# EAGLE schematic XMICRO-SERIAL V1.1 (EAGLE 6.3)

## Sheet 1 of 6: UARTs
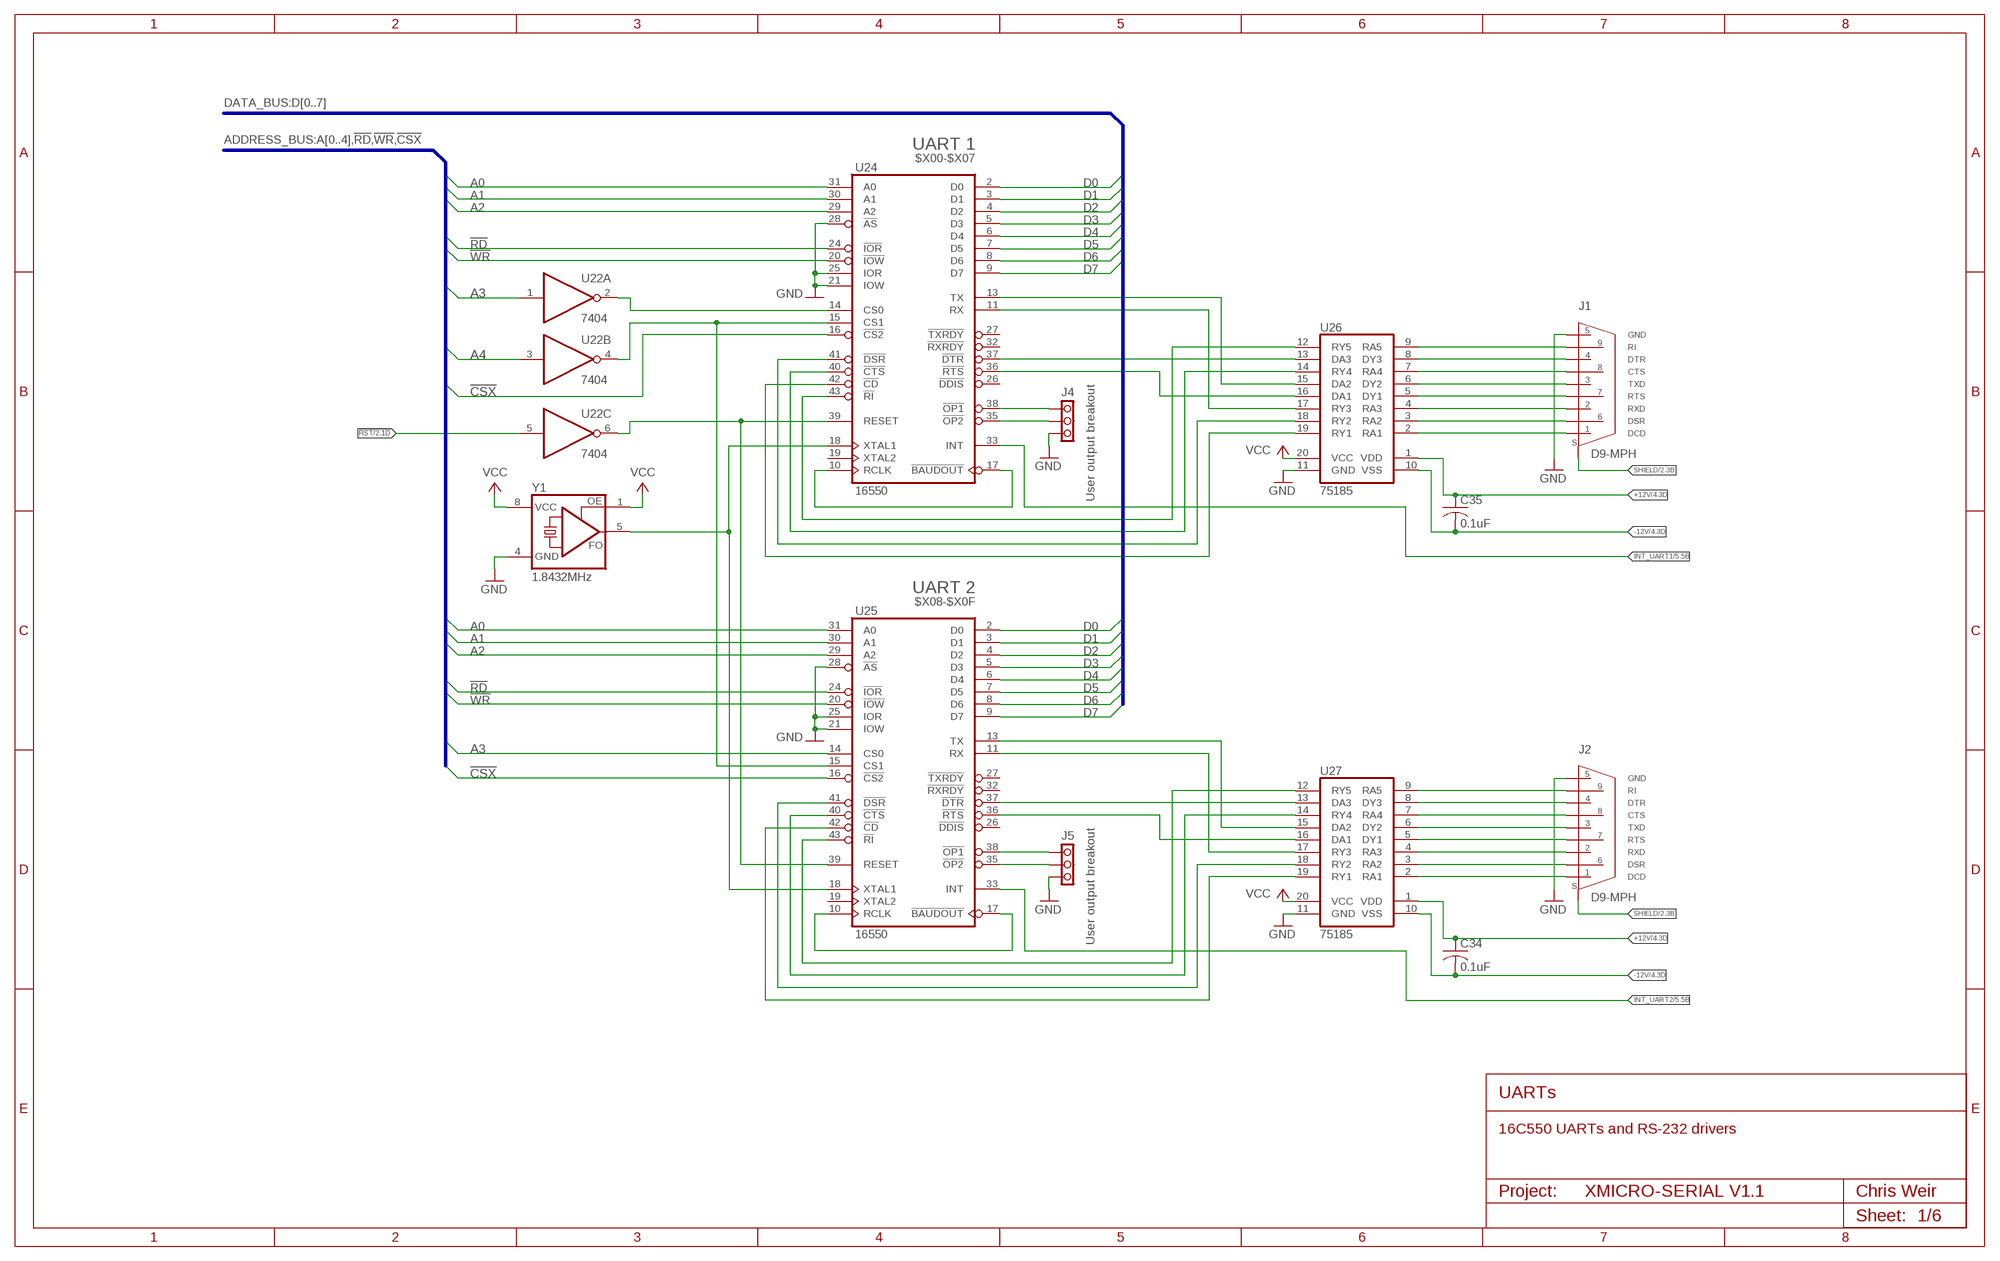
[diagram p0: schematic, sheet 1]

### Parts
C34  0.1uF  C-US100  [C100]
C35  0.1uF  C-US100  [C100]
J1  D9-MPH  [D9-H]
J2  D9-MPH  [D9-H]
J4  PINHD1X3  [1X03]
J5  PINHD1X3  [1X03]
U22  7404  74LS04N  [DIL14]
U24  16550  16C550S44  [S44]
U25  16550  16C550S44  [S44]
U26  75185  75C185N  [DIL20]
U27  75185  75C185N  [DIL20]
Y1  1.8432MHz  OSC-OE  [DIL08S]

### Nets
!CSX: U24.16(!CS2) U25.16(!CS2) ; also sheet 4,5
!RD: U24.24(!IOR) U25.24(!IOR) ; also sheet 4,5
!RST: U22.5(C:I) ; also sheet 2,3,4
!WR: U24.20(!IOW) U25.20(!IOW) ; also sheet 4,5
+12V [SUPPLY]: C34.P$1 C35.P$1 U26.1(VDD) U27.1(VDD) ; also sheet 4,6
-12V [SUPPLY]: C34.P$2 C35.P$2 U26.10(VSS) U27.10(VSS) ; also sheet 4,6
A0: U24.31(A0) U25.31(A0) ; also sheet 4,5
A1: U24.30(A1) U25.30(A1) ; also sheet 4,5
A2: U24.29(A2) U25.29(A2) ; also sheet 4,5
A3: U22.1(A:I) U25.14(CS0) ; also sheet 4
A4: U22.3(B:I) ; also sheet 4,5
D0: U24.2(D0) U25.2(D0) ; also sheet 2,3,4,5
D1: U24.3(D1) U25.3(D1) ; also sheet 2,3,4,5
D2: U24.4(D2) U25.4(D2) ; also sheet 2,3,4,5
D3: U24.5(D3) U25.5(D3) ; also sheet 2,3,4,5
D4: U24.6(D4) U25.6(D4) ; also sheet 2,3,4,5
D5: U24.7(D5) U25.7(D5) ; also sheet 2,3,4,5
D6: U24.8(D6) U25.8(D6) ; also sheet 2,3,4,5
D7: U24.9(D7) U25.9(D7) ; also sheet 2,3,4,5
GND [GND]: J1.P$5 J2.P$5 J4.3 J5.3 U24.21(IOW) U24.25(IOR) U24.28(!AS) U25.21(IOW) U25.25(IOR) U25.28(!AS) U26.11(GND) U27.11(GND) Y1.4(GND) ; also sheet 2,3,4,5,6
INT_UART1: U24.33(INT) ; also sheet 5,6
INT_UART2: U25.33(INT) ; also sheet 5,6
N$1: J1.P$1 U26.2(RA1)
N$2: J1.P$2 U26.4(RA3)
N$3: J1.P$3 U26.6(DY2)
N$4: J1.P$4 U26.8(DY3)
N$5: J1.P$6 U26.3(RA2)
N$6: J1.P$7 U26.5(DY1)
N$7: J1.P$8 U26.7(RA4)
N$8: J1.P$9 U26.9(RA5)
N$9: J2.P$1 U27.2(RA1)
N$10: U24.43(!RI) U26.12(RY5)
N$11: U24.37(!DTR) U26.13(DA3)
N$12: U24.40(!CTS) U26.14(RY4)
N$13: U24.13(TX) U26.15(DA2)
N$14: U24.36(!RTS) U26.16(DA1)
N$15: U24.11(RX) U26.17(RY3)
N$16: U24.41(!DSR) U26.18(RY2)
N$17: U24.42(!CD) U26.19(RY1)
N$18: U24.10(RCLK) U24.17(!BAUDOUT)
N$26: U22.6(C:O) U24.39(RESET) U25.39(RESET)
N$28: J2.P$2 U27.4(RA3)
N$29: J2.P$3 U27.6(DY2)
N$30: J2.P$4 U27.8(DY3)
N$31: J2.P$6 U27.3(RA2)
N$32: J2.P$7 U27.5(DY1)
N$41: J2.P$8 U27.7(RA4)
N$42: J2.P$9 U27.9(RA5)
N$47: U25.43(!RI) U27.12(RY5)
N$48: U25.37(!DTR) U27.13(DA3)
N$49: U25.40(!CTS) U27.14(RY4)
N$60: U25.13(TX) U27.15(DA2)
N$61: U25.36(!RTS) U27.16(DA1)
N$62: U25.11(RX) U27.17(RY3)
N$63: U25.41(!DSR) U27.18(RY2)
N$64: U25.42(!CD) U27.19(RY1)
N$65: U25.10(RCLK) U25.17(!BAUDOUT)
N$112: U22.2(A:O) U24.14(CS0)
N$114: U22.4(B:O) U24.15(CS1) U25.15(CS1)
N$116: U24.18(XTAL1) U25.18(XTAL1) Y1.5(FO)
N$122: J5.1 U25.38(!OP1)
N$123: J5.2 U25.35(!OP2)
N$125: J4.1 U24.38(!OP1)
N$136: J4.2 U24.35(!OP2)
SHIELD [SHIELD]: J1.S1 J1.S2 J2.S1 J2.S2 ; also sheet 2,6
VCC [SUPPLY]: U26.20(VCC) U27.20(VCC) Y1.1(OE) Y1.8(VCC) ; also sheet 2,3,4,6
Unconnected: U24.19(XTAL2) U24.26(!DDIS) U24.27(!TXRDY) U24.32(!RXRDY) U25.19(XTAL2) U25.26(!DDIS) U25.27(!TXRDY) U25.32(!RXRDY)

### Buses
DATA_BUS:D[0..7]
ADDRESS_BUS:A[0..4],!RD,!WR,!CSX

### Notes on the sheet
- UART 1
- $X00-$X07
- GND
- RI
- DTR
- CTS
- User output breakout | TXD
- RTS
- RXD
- DSR
- DCD
- UART 2
- $X08-$X0F
- GND
- RI
- DTR
- CTS
- User output breakout | TXD
- RTS
- RXD
- DSR
- DCD
- UARTs
- 16C550 UARTs and RS-232 drivers
- Project: | Chris Weir
- Sheet:

## Sheet 2 of 6: PS/2 Read
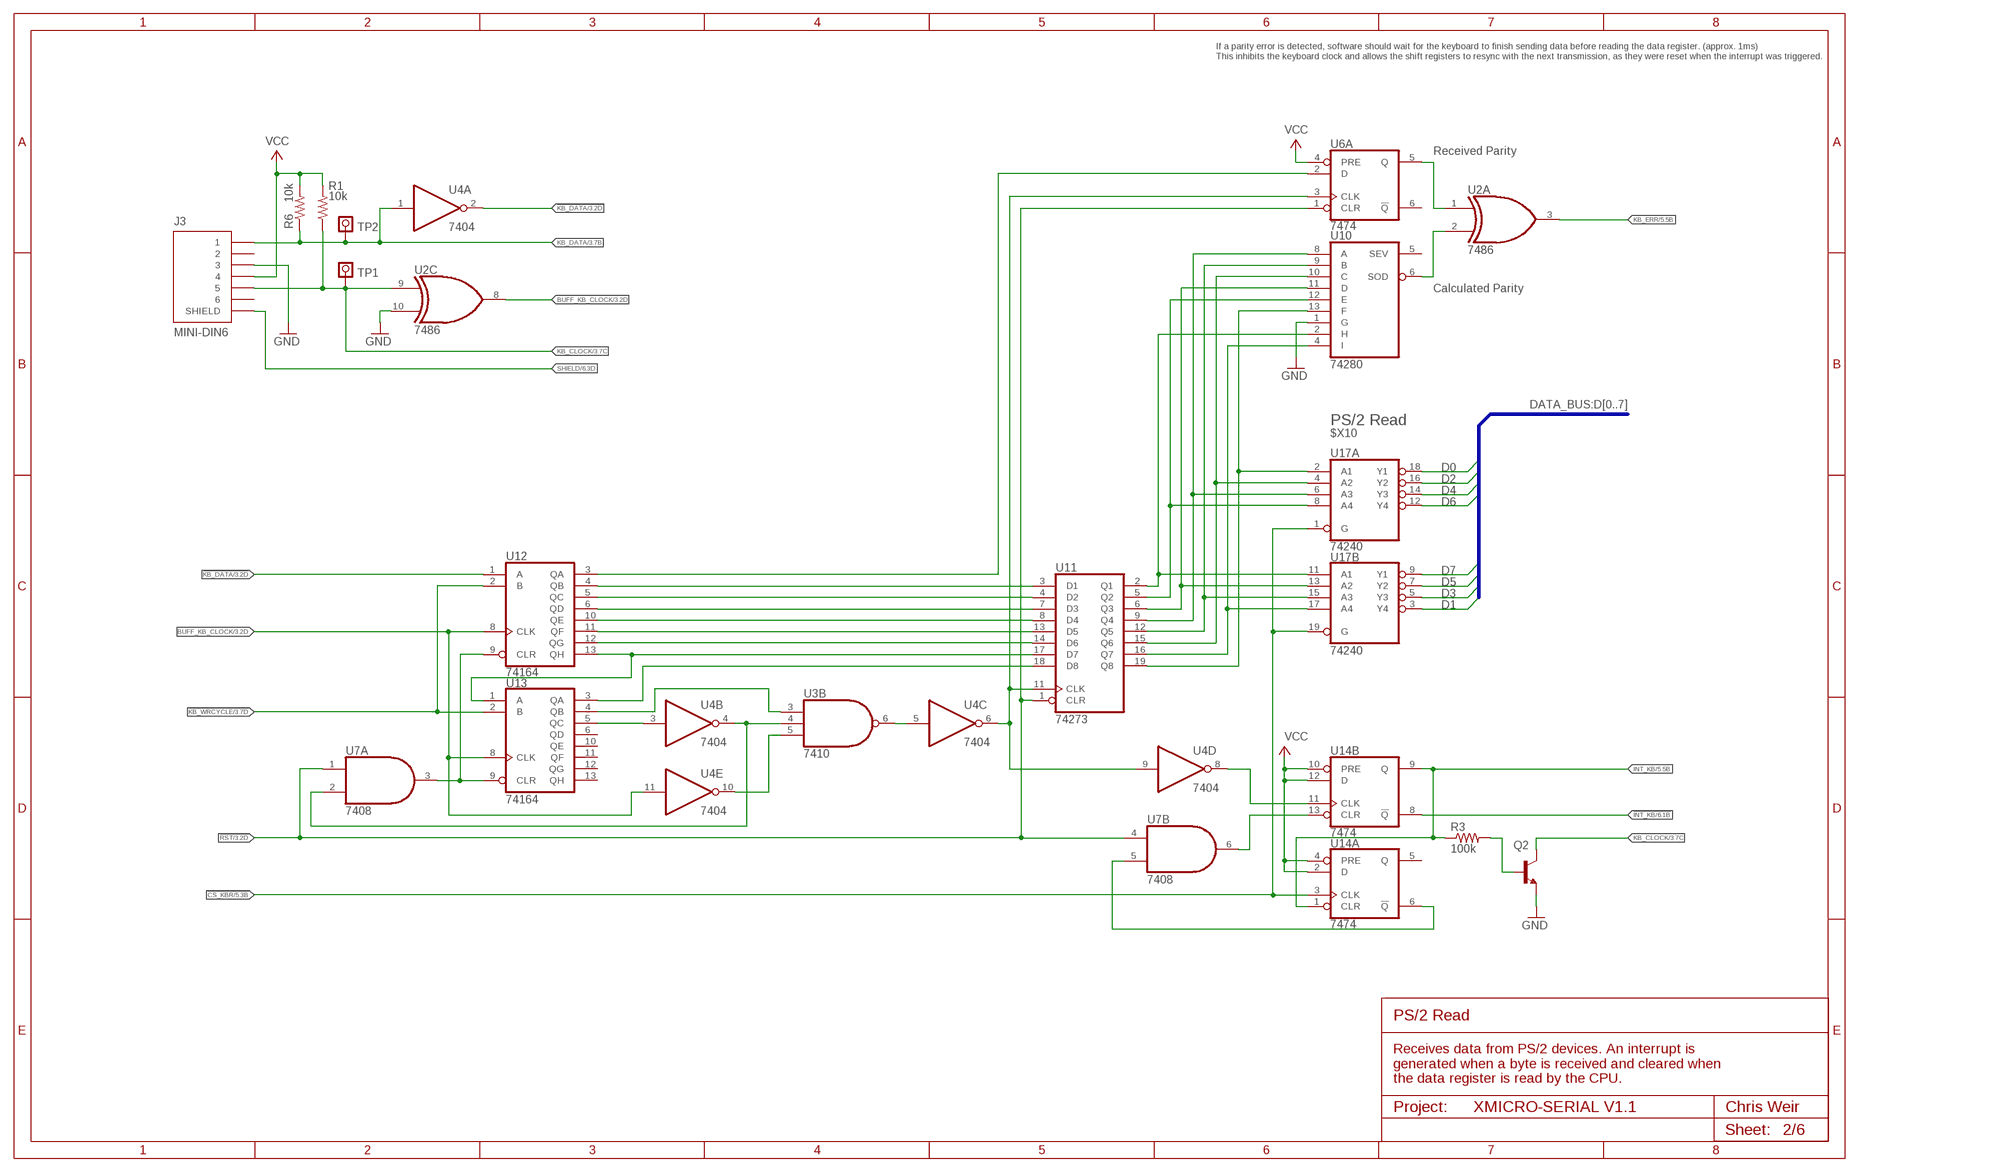
[diagram p1: schematic, sheet 2]

### Parts
J3  MINI-DIN6  [MINI-DIN6]
Q2  2N5088  TRANSISTOR-NPN-2N5088  [TO92]
R1  10k  R-US_0207/10  [0207/10]
R3  100k  R-US_0207/10  [0207/10]
R6  10k  R-US_0207/10  [0207/10]
TP1  PINHD-1X1  [1X01]
TP2  PINHD-1X1  [1X01]
U2  7486  74LS86N  [DIL14]
U3  7410  74LS10N  [DIL14]
U4  7404  74LS04N  [DIL14]
U6  7474  74LS74N  [DIL14]
U7  7408  74LS08N  [DIL14]
U10  74280  74LS280N  [DIL14]
U11  74273  74273N  [DIL20]
U12  74164  74HCT164N  [DIL14]
U13  74164  74HCT164N  [DIL14]
U14  7474  74LS74N  [DIL14]
U17  74240  74LS240N  [DIL20]

### Nets
!CS_KBR: U14.3(A:CLK) U17.1(A:G) U17.19(B:G) ; also sheet 5
!INT_KB: U14.8(B:!Q) ; also sheet 6
!KB_DATA: U4.2(A:O) U12.1(A) ; also sheet 3
!KB_WRCYCLE: U12.2(B) U13.2(B) ; also sheet 3
!RST: U6.1(A:CLR) U7.1(A:I0) U7.4(B:I0) U11.1(CLR) ; also sheet 1,3,4
BUFF_KB_CLOCK: U2.8(C:O) U4.11(E:I) U12.8(CLK) U13.8(CLK) ; also sheet 3
D0: U17.18(A:Y1) ; also sheet 1,3,4,5
D1: U17.3(B:Y4) ; also sheet 1,3,4,5
D2: U17.16(A:Y2) ; also sheet 1,3,4,5
D3: U17.5(B:Y3) ; also sheet 1,3,4,5
D4: U17.14(A:Y3) ; also sheet 1,3,4,5
D5: U17.7(B:Y2) ; also sheet 1,3,4,5
D6: U17.12(A:Y4) ; also sheet 1,3,4,5
D7: U17.9(B:Y1) ; also sheet 1,3,4,5
GND [GND]: J3.3 Q2.1(E) U2.10(C:I1) U10.1(G) ; also sheet 1,3,4,5,6
INT_KB: R3.1 U14.1(A:CLR) U14.9(B:Q) ; also sheet 5
KB_CLOCK: J3.5 Q2.3(C) R1.1 TP1.1 U2.9(C:I0) ; also sheet 3
KB_DATA: J3.1 R6.1 TP2.1 U4.1(A:I) ; also sheet 3
KB_ERR: U2.3(A:O) ; also sheet 5
N$19: U3.6(B:O) U4.5(C:I)
N$20: U4.8(D:O) U14.11(B:CLK)
N$66: U11.17(D7) U12.13(QH) U13.1(A)
N$67: U11.18(D8) U13.3(QA)
N$69: U4.3(B:I) U13.5(QC)
N$70: U3.4(B:I1) U4.4(B:O) U7.2(A:I1)
N$71: U4.6(C:O) U4.9(D:I) U6.3(A:CLK) U11.11(CLK)
N$72: U3.3(B:I0) U13.4(QB)
N$73: U11.14(D6) U12.12(QG)
N$74: U11.13(D5) U12.11(QF)
N$76: U11.7(D3) U12.6(QD)
N$77: U11.4(D2) U12.5(QC)
N$78: U11.3(D1) U12.4(QB)
N$79: U6.2(A:D) U12.3(QA)
N$81: U7.3(A:O) U12.9(CLR) U13.9(CLR)
N$82: U7.6(B:O) U14.13(B:CLR)
N$84: U2.1(A:I0) U6.5(A:Q)
N$86: U10.13(F) U11.19(Q8) U17.2(A:A1)
N$90: U10.4(I) U11.16(Q7) U17.17(B:A4)
N$91: U10.10(C) U11.15(Q6) U17.4(A:A2)
N$92: U10.9(B) U11.12(Q5) U17.15(B:A3)
N$94: U10.11(D) U11.6(Q3) U17.13(B:A2)
N$95: U10.12(E) U11.5(Q2) U17.8(A:A4)
N$96: U10.2(H) U11.2(Q1) U17.11(B:A1)
N$97: U10.8(A) U11.9(Q4) U17.6(A:A3)
N$101: U2.2(A:I1) U10.6(SOD)
N$102: U3.5(B:I2) U4.10(E:O)
N$105: Q2.2(B) R3.2
N$108: U7.5(B:I1) U14.6(A:!Q)
SHIELD [SHIELD]: J3.G$1(SHIELD) J3.G$2(SHIELD) J3.G$3(SHIELD) ; also sheet 1,6
UC4: U11.8(D4) U12.10(QE)
VCC [SUPPLY]: J3.4 R1.2 R6.2 U6.4(A:PRE) U14.2(A:D) U14.4(A:PRE) U14.10(B:PRE) U14.12(B:D) ; also sheet 1,3,4,6
Unconnected: J3.2 J3.6 U6.6(A:!Q) U10.5(SEV) U13.6(QD) U13.10(QE) U13.11(QF) U13.12(QG) U13.13(QH) U14.5(A:Q)

### Buses
DATA_BUS:D[0..7]

### Notes on the sheet
- If a parity error is detected, software should wait for the keyboard to finish sending data before reading the data register. (approx. 1ms)
  This inhibits the keyboard clock and allows the shift registers to resync with the next transmission, as they were reset when the interrupt was triggered.
- Received Parity
- Calculated Parity
- PS/2 Read
- $X10
- PS/2 Read
- Receives data from PS/2 devices. An interrupt is
  generated when a byte is received and cleared when
  the data register is read by the CPU.
- Project: | Chris Weir
- Sheet:

## Sheet 3 of 6: PS/2 Write
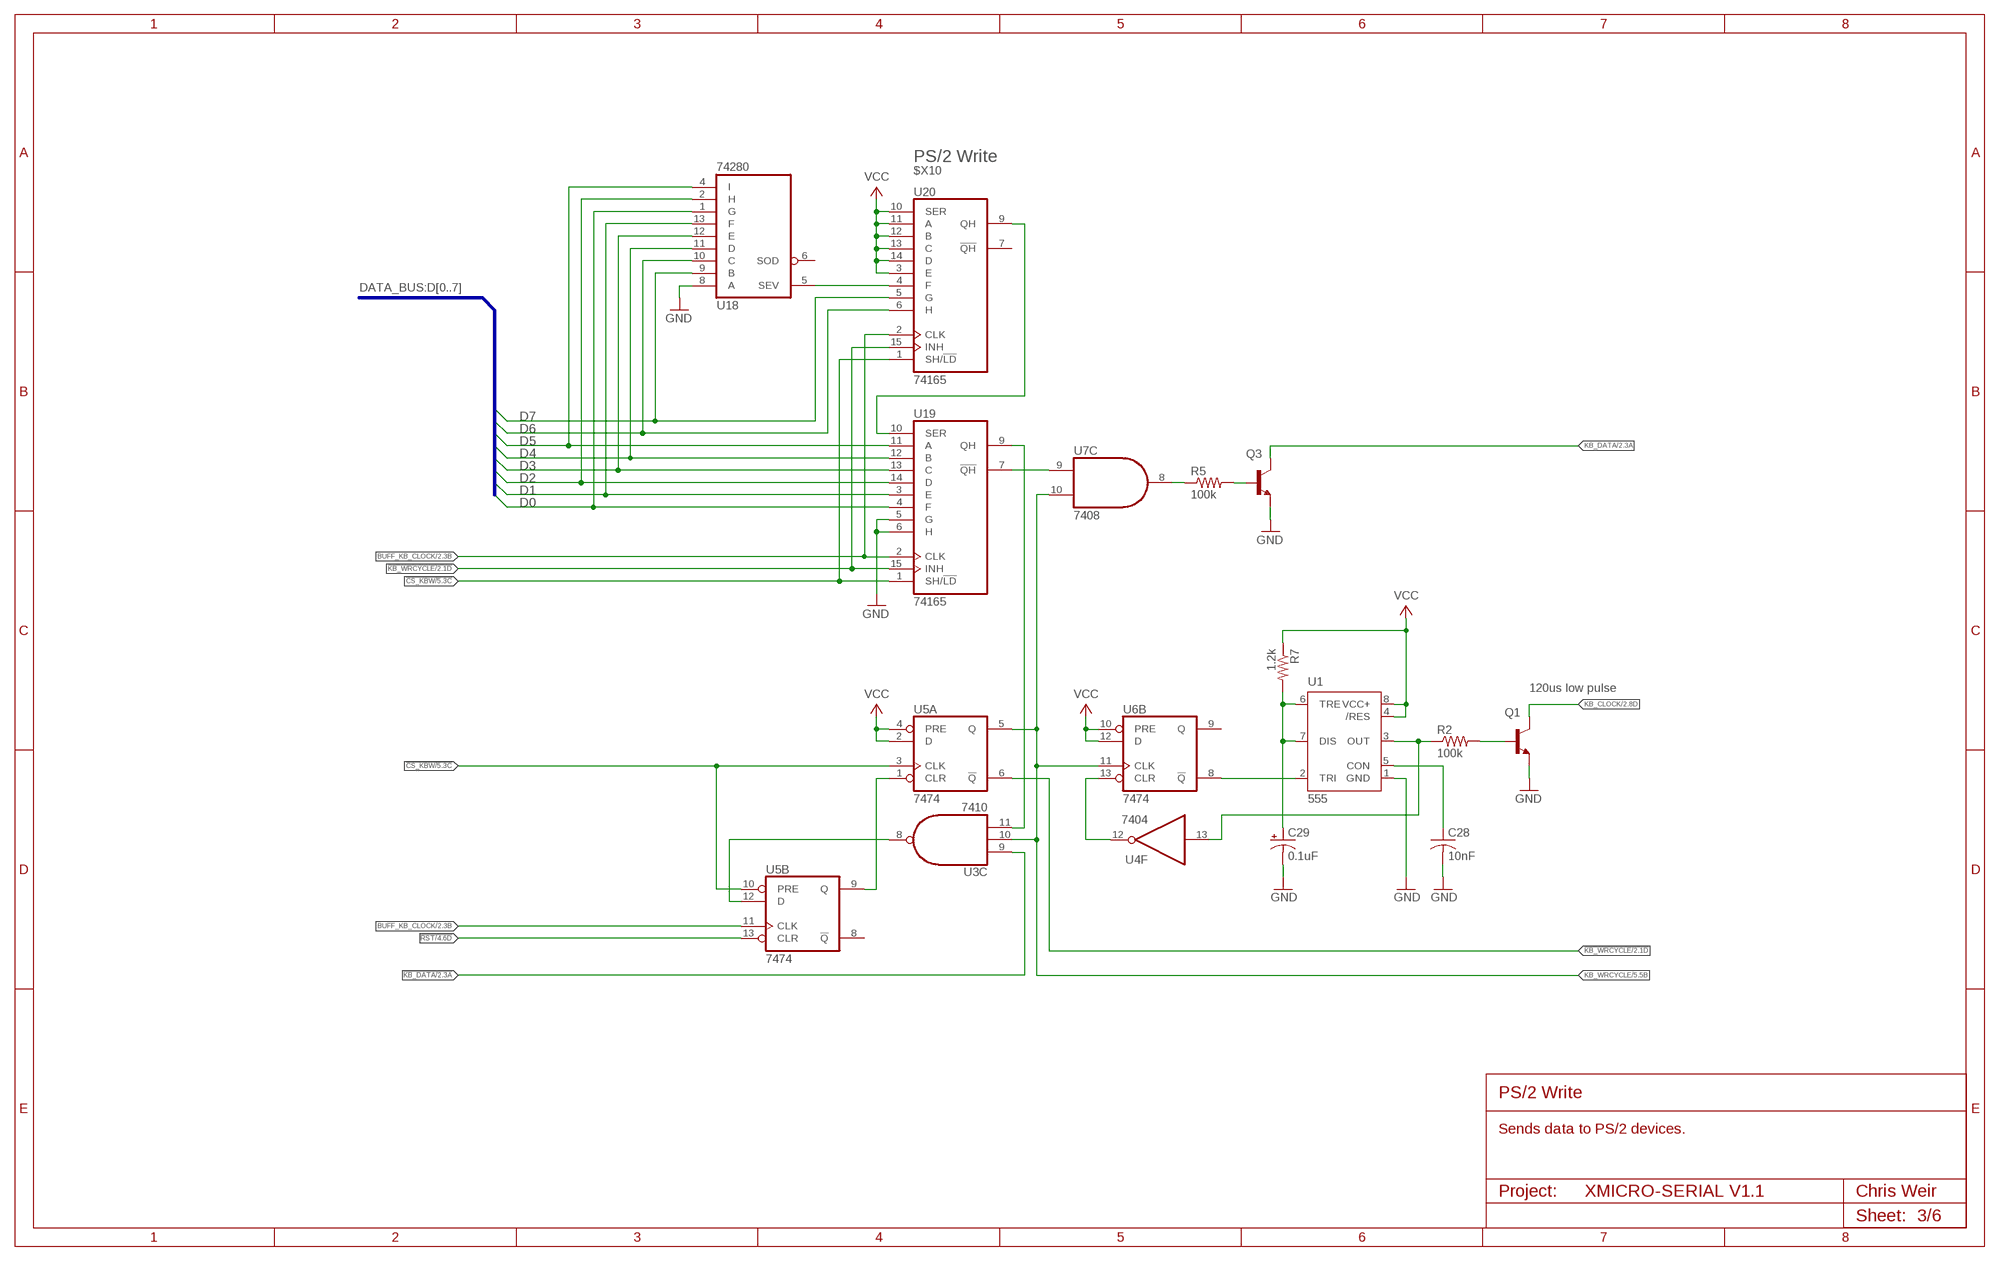
[diagram p2: schematic, sheet 3]

### Parts
C28  10nF  C-US100  [C100]
C29  0.1uF  CPOL-USE2.5-6  [E2,5-6]
Q1  2N5088  TRANSISTOR-NPN-2N5088  [TO92]
Q3  2N5088  TRANSISTOR-NPN-2N5088  [TO92]
R2  100k  R-US_0207/10  [0207/10]
R5  100k  R-US_0207/10  [0207/10]
R7  1.2k  R-US_0207/10  [0207/10]
U1  555  NE555  [DIL-08]
U5  7474  74LS74N  [DIL14]
U18  74280  74LS280N  [DIL14]
U19  74165  74LS165N  [DIL16]
U20  74165  74LS165N  [DIL16]

### Nets
!CS_KBW: U5.3(A:CLK) U5.10(B:PRE) U19.1(SH/!LD) U20.1(SH/!LD) ; also sheet 5
!KB_DATA: U3.9(C:I0) ; also sheet 2
!KB_WRCYCLE: U5.6(A:!Q) U19.15(INH) U20.15(INH) ; also sheet 2
!RST: U5.13(B:CLR) ; also sheet 1,2,4
BUFF_KB_CLOCK: U5.11(B:CLK) U19.2(CLK) U20.2(CLK) ; also sheet 2
D0: U18.1(G) U19.4(F) ; also sheet 1,2,4,5
D1: U18.13(F) U19.3(E) ; also sheet 1,2,4,5
D2: U18.2(H) U19.14(D) ; also sheet 1,2,4,5
D3: U18.12(E) U19.13(C) ; also sheet 1,2,4,5
D4: U18.11(D) U19.12(B) ; also sheet 1,2,4,5
D5: U18.4(I) U19.11(A) ; also sheet 1,2,4,5
D6: U18.10(C) U20.6(H) ; also sheet 1,2,4,5
D7: U18.9(B) U20.5(G) ; also sheet 1,2,4,5
GND [GND]: C28.P$2 C29.- Q1.1(E) Q3.1(E) U1.1(GND) U18.8(A) U19.5(G) U19.6(H) ; also sheet 1,2,4,5,6
KB_CLOCK: Q1.3(C) ; also sheet 2
KB_DATA: Q3.3(C) ; also sheet 2
KB_WRCYCLE: U3.10(C:I1) U5.5(A:Q) U6.11(B:CLK) U7.10(C:I1) ; also sheet 5
N$22: U3.8(C:O) U5.12(B:D)
N$23: U4.12(F:O) U6.13(B:CLR)
N$87: U3.11(C:I2) U19.9(QH)
N$99: U7.9(C:I0) U19.7(!QH)
N$103: R5.1 U7.8(C:O)
N$111: U19.10(SER) U20.9(QH)
N$120: U18.5(SEV) U20.4(F)
N$124: Q3.2(B) R5.2
N$126: Q1.2(B) R2.2
N$131: U5.1(A:CLR) U5.9(B:Q)
N$132: U1.2(TRI) U6.8(B:!Q)
N$133: C29.+ R7.2 U1.6(TRE) U1.7(DIS)
N$137: R2.1 U1.3(OUT) U4.13(F:I)
N$140: C28.P$1 U1.5(CON)
VCC [SUPPLY]: R7.1 U1.4(/RES) U1.8(VCC+) U5.2(A:D) U5.4(A:PRE) U6.10(B:PRE) U6.12(B:D) U20.3(E) U20.10(SER) U20.11(A) U20.12(B) U20.13(C) U20.14(D) ; also sheet 1,2,4,6
Unconnected: U5.8(B:!Q) U6.9(B:Q) U18.6(SOD) U20.7(!QH)

### Buses
DATA_BUS:D[0..7]

### Notes on the sheet
- PS/2 Write
- $X10
- 120us low pulse
- PS/2 Write
- Sends data to PS/2 devices.
- Project: | Chris Weir
- Sheet:

## Sheet 4 of 6: Bus Connector/Buffers
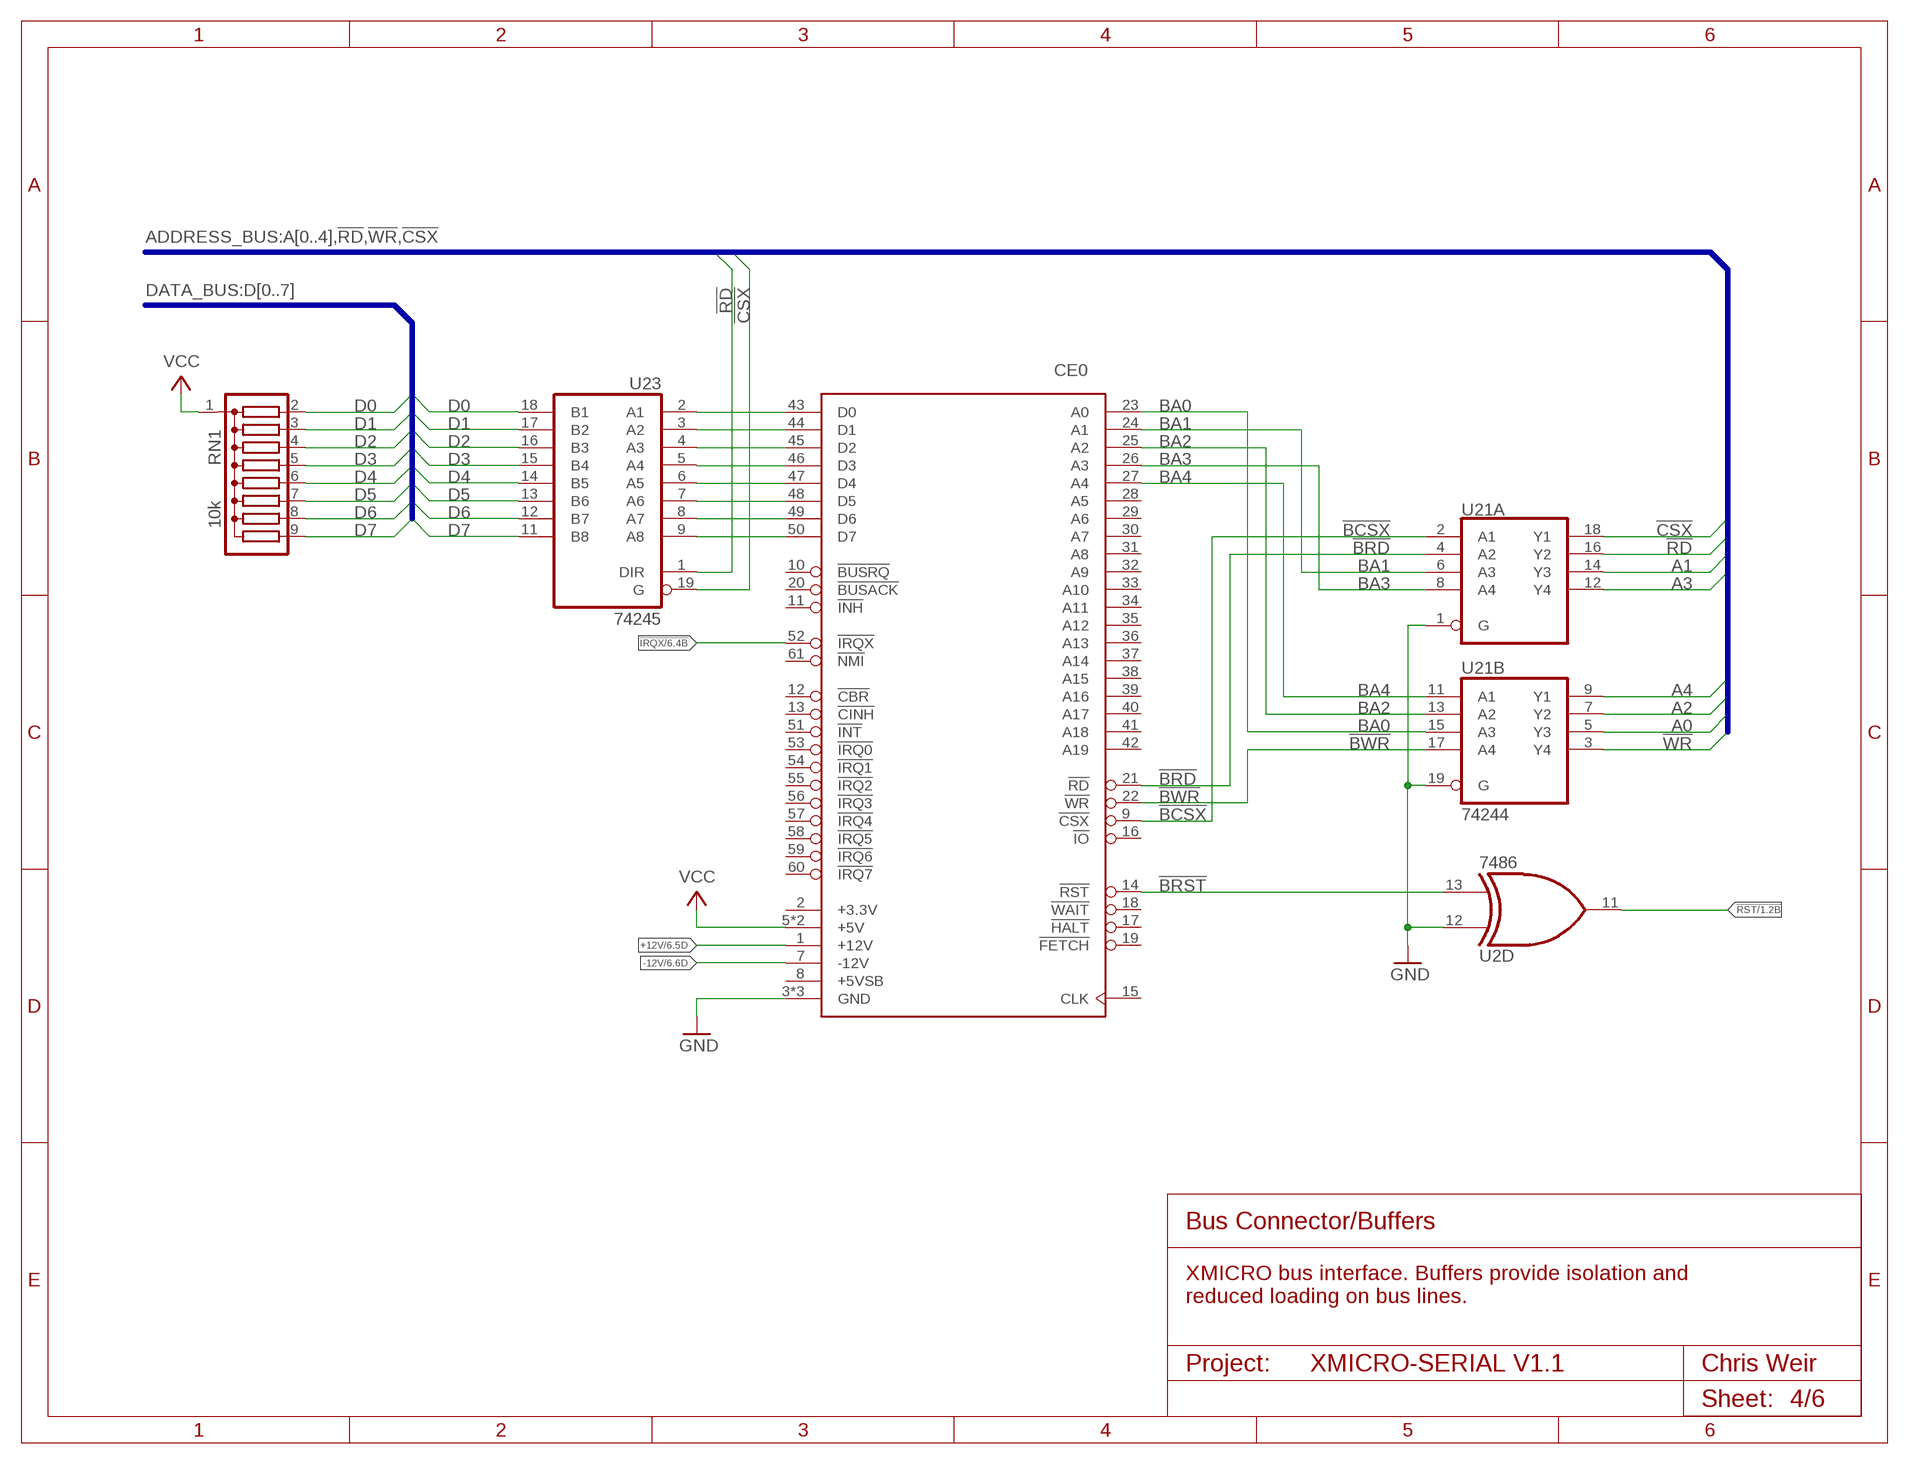
[diagram p3: schematic, sheet 4]

### Parts
CE0  XMICRO-BUS-EDGE62M  [EDGE62M]
RN1  10k  G08R  [SIL9]
U21  74244  74LS244N  [DIL20]
U23  74245  74LS245N  [DIL20]

### Nets
!BCSX: CE0.9(!CSX) U21.2(A:A1)
!BRD: CE0.21(!RD) U21.4(A:A2)
!BRST: CE0.14(!RST) U2.13(D:I1)
!BWR: CE0.22(!WR) U21.17(B:A4)
!CSX: U21.18(A:Y1) U23.19(G) ; also sheet 1,5
!IRQX: CE0.52(!IRQX) ; also sheet 6
!RD: U21.16(A:Y2) U23.1(DIR) ; also sheet 1,5
!RST: U2.11(D:O) ; also sheet 1,2,3
!WR: U21.3(B:Y4) ; also sheet 1,5
+12V [SUPPLY]: CE0.1(+12V) ; also sheet 1,6
-12V [SUPPLY]: CE0.7(-12V) ; also sheet 1,6
A0: U21.5(B:Y3) ; also sheet 1,5
A1: U21.14(A:Y3) ; also sheet 1,5
A2: U21.7(B:Y2) ; also sheet 1,5
A3: U21.12(A:Y4) ; also sheet 1
A4: U21.9(B:Y1) ; also sheet 1,5
BA0: CE0.23(A0) U21.15(B:A3)
BA1: CE0.24(A1) U21.6(A:A3)
BA2: CE0.25(A2) U21.13(B:A2)
BA3: CE0.26(A3) U21.8(A:A4)
BA4: CE0.27(A4) U21.11(B:A1)
D0: RN1.2 U23.18(B1) ; also sheet 1,2,3,5
D1: RN1.3 U23.17(B2) ; also sheet 1,2,3,5
D2: RN1.4 U23.16(B3) ; also sheet 1,2,3,5
D3: RN1.5 U23.15(B4) ; also sheet 1,2,3,5
D4: RN1.6 U23.14(B5) ; also sheet 1,2,3,5
D5: RN1.7 U23.13(B6) ; also sheet 1,2,3,5
D6: RN1.8 U23.12(B7) ; also sheet 1,2,3,5
D7: RN1.9 U23.11(B8) ; also sheet 1,2,3,5
GND [GND]: CE0.3(GND) CE0.4(GND) CE0.62(GND) U2.12(D:I0) U21.1(A:G) U21.19(B:G) ; also sheet 1,2,3,5,6
N$33: CE0.50(D7) U23.9(A8)
N$34: CE0.49(D6) U23.8(A7)
N$35: CE0.48(D5) U23.7(A6)
N$36: CE0.47(D4) U23.6(A5)
N$37: CE0.46(D3) U23.5(A4)
N$38: CE0.45(D2) U23.4(A3)
N$39: CE0.44(D1) U23.3(A2)
N$40: CE0.43(D0) U23.2(A1)
VCC [SUPPLY]: CE0.5(+5V) CE0.6(+5V) RN1.1 ; also sheet 1,2,3,6
Unconnected: CE0.2(+3.3V) CE0.8(+5VSB) CE0.10(!BUSRQ) CE0.11(!INH) CE0.12(!CBR) CE0.13(!CINH) CE0.15(CLK) CE0.16(!IO) CE0.17(!HALT) CE0.18(!WAIT) CE0.19(!FETCH) CE0.20(!BUSACK) CE0.28(A5) CE0.29(A6) CE0.30(A7) CE0.31(A8) CE0.32(A9) CE0.33(A10) CE0.34(A11) CE0.35(A12) CE0.36(A13) CE0.37(A14) CE0.38(A15) CE0.39(A16) CE0.40(A17) CE0.41(A18) CE0.42(A19) CE0.51(!INT) CE0.53(!IRQ0) CE0.54(!IRQ1) CE0.55(!IRQ2) CE0.56(!IRQ3) CE0.57(!IRQ4) CE0.58(!IRQ5) CE0.59(!IRQ6) CE0.60(!IRQ7) CE0.61(!NMI)

### Buses
DATA_BUS:D[0..7]
ADDRESS_BUS:A[0..4],!RD,!WR,!CSX

### Notes on the sheet
- Bus Connector/Buffers
- XMICRO bus interface. Buffers provide isolation and 
  reduced loading on bus lines.
- Project: | Chris Weir
- Sheet:

## Sheet 5 of 6: Chip Selects/Card Registers
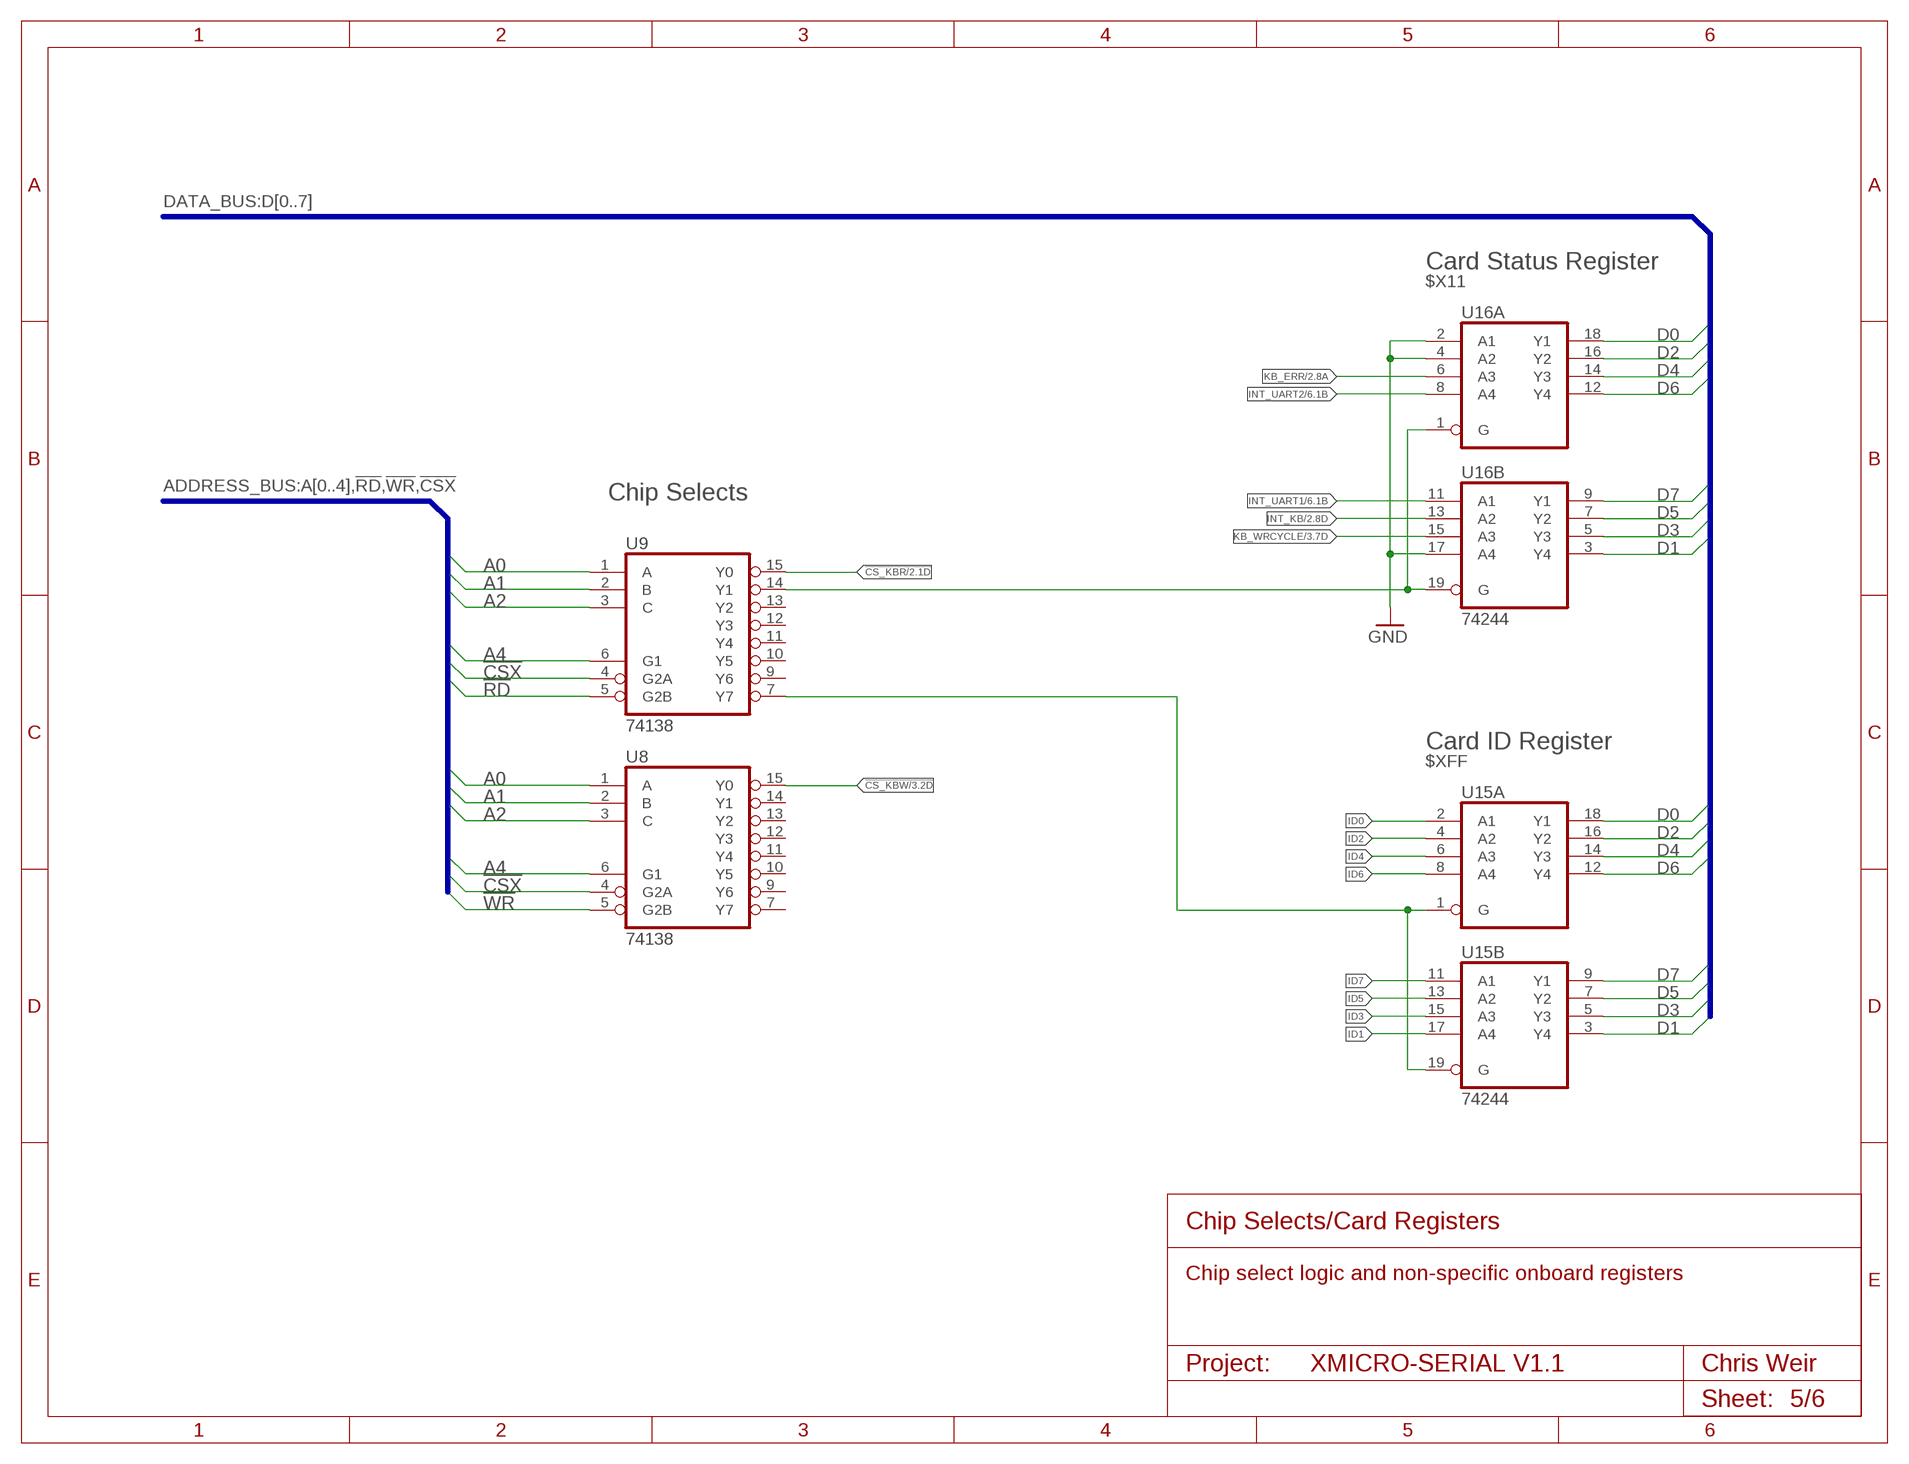
[diagram p4: schematic, sheet 5]

### Parts
U8  74138  74LS138N  [DIL16]
U9  74138  74LS138N  [DIL16]
U15  74244  74LS244N  [DIL20]
U16  74244  74LS244N  [DIL20]

### Nets
!CS_IDR: U9.7(Y7) U15.1(A:G) U15.19(B:G)
!CS_KBR: U9.15(Y0) ; also sheet 2
!CS_KBW: U8.15(Y0) ; also sheet 3
!CS_STR: U9.14(Y1) U16.1(A:G) U16.19(B:G)
!CSX: U8.4(G2A) U9.4(G2A) ; also sheet 1,4
!RD: U9.5(G2B) ; also sheet 1,4
!WR: U8.5(G2B) ; also sheet 1,4
A0: U8.1(A) U9.1(A) ; also sheet 1,4
A1: U8.2(B) U9.2(B) ; also sheet 1,4
A2: U8.3(C) U9.3(C) ; also sheet 1,4
A4: U8.6(G1) U9.6(G1) ; also sheet 1,4
D0: U15.18(A:Y1) U16.18(A:Y1) ; also sheet 1,2,3,4
D1: U15.3(B:Y4) U16.3(B:Y4) ; also sheet 1,2,3,4
D2: U15.16(A:Y2) U16.16(A:Y2) ; also sheet 1,2,3,4
D3: U15.5(B:Y3) U16.5(B:Y3) ; also sheet 1,2,3,4
D4: U15.14(A:Y3) U16.14(A:Y3) ; also sheet 1,2,3,4
D5: U15.7(B:Y2) U16.7(B:Y2) ; also sheet 1,2,3,4
D6: U15.12(A:Y4) U16.12(A:Y4) ; also sheet 1,2,3,4
D7: U15.9(B:Y1) U16.9(B:Y1) ; also sheet 1,2,3,4
GND [GND]: U16.2(A:A1) U16.4(A:A2) U16.17(B:A4) ; also sheet 1,2,3,4,6
ID0: U15.2(A:A1)
ID1: U15.17(B:A4)
ID2: U15.4(A:A2)
ID3: U15.15(B:A3)
ID4: U15.6(A:A3)
ID5: U15.13(B:A2)
ID6: U15.8(A:A4)
ID7: U15.11(B:A1)
INT_KB: U16.13(B:A2) ; also sheet 2
INT_UART1: U16.11(B:A1) ; also sheet 1,6
INT_UART2: U16.8(A:A4) ; also sheet 1,6
KB_ERR: U16.6(A:A3) ; also sheet 2
KB_WRCYCLE: U16.15(B:A3) ; also sheet 3
Unconnected: U8.7(Y7) U8.9(Y6) U8.10(Y5) U8.11(Y4) U8.12(Y3) U8.13(Y2) U8.14(Y1) U9.9(Y6) U9.10(Y5) U9.11(Y4) U9.12(Y3) U9.13(Y2)

### Buses
DATA_BUS:D[0..7]
ADDRESS_BUS:A[0..4],!RD,!WR,!CSX

### Notes on the sheet
- Card Status Register
- $X11
- Chip Selects
- Card ID Register
- $XFF
- Chip Selects/Card Registers
- Chip select logic and non-specific onboard registers
- Project: | Chris Weir
- Sheet:

## Sheet 6 of 6: Misc.
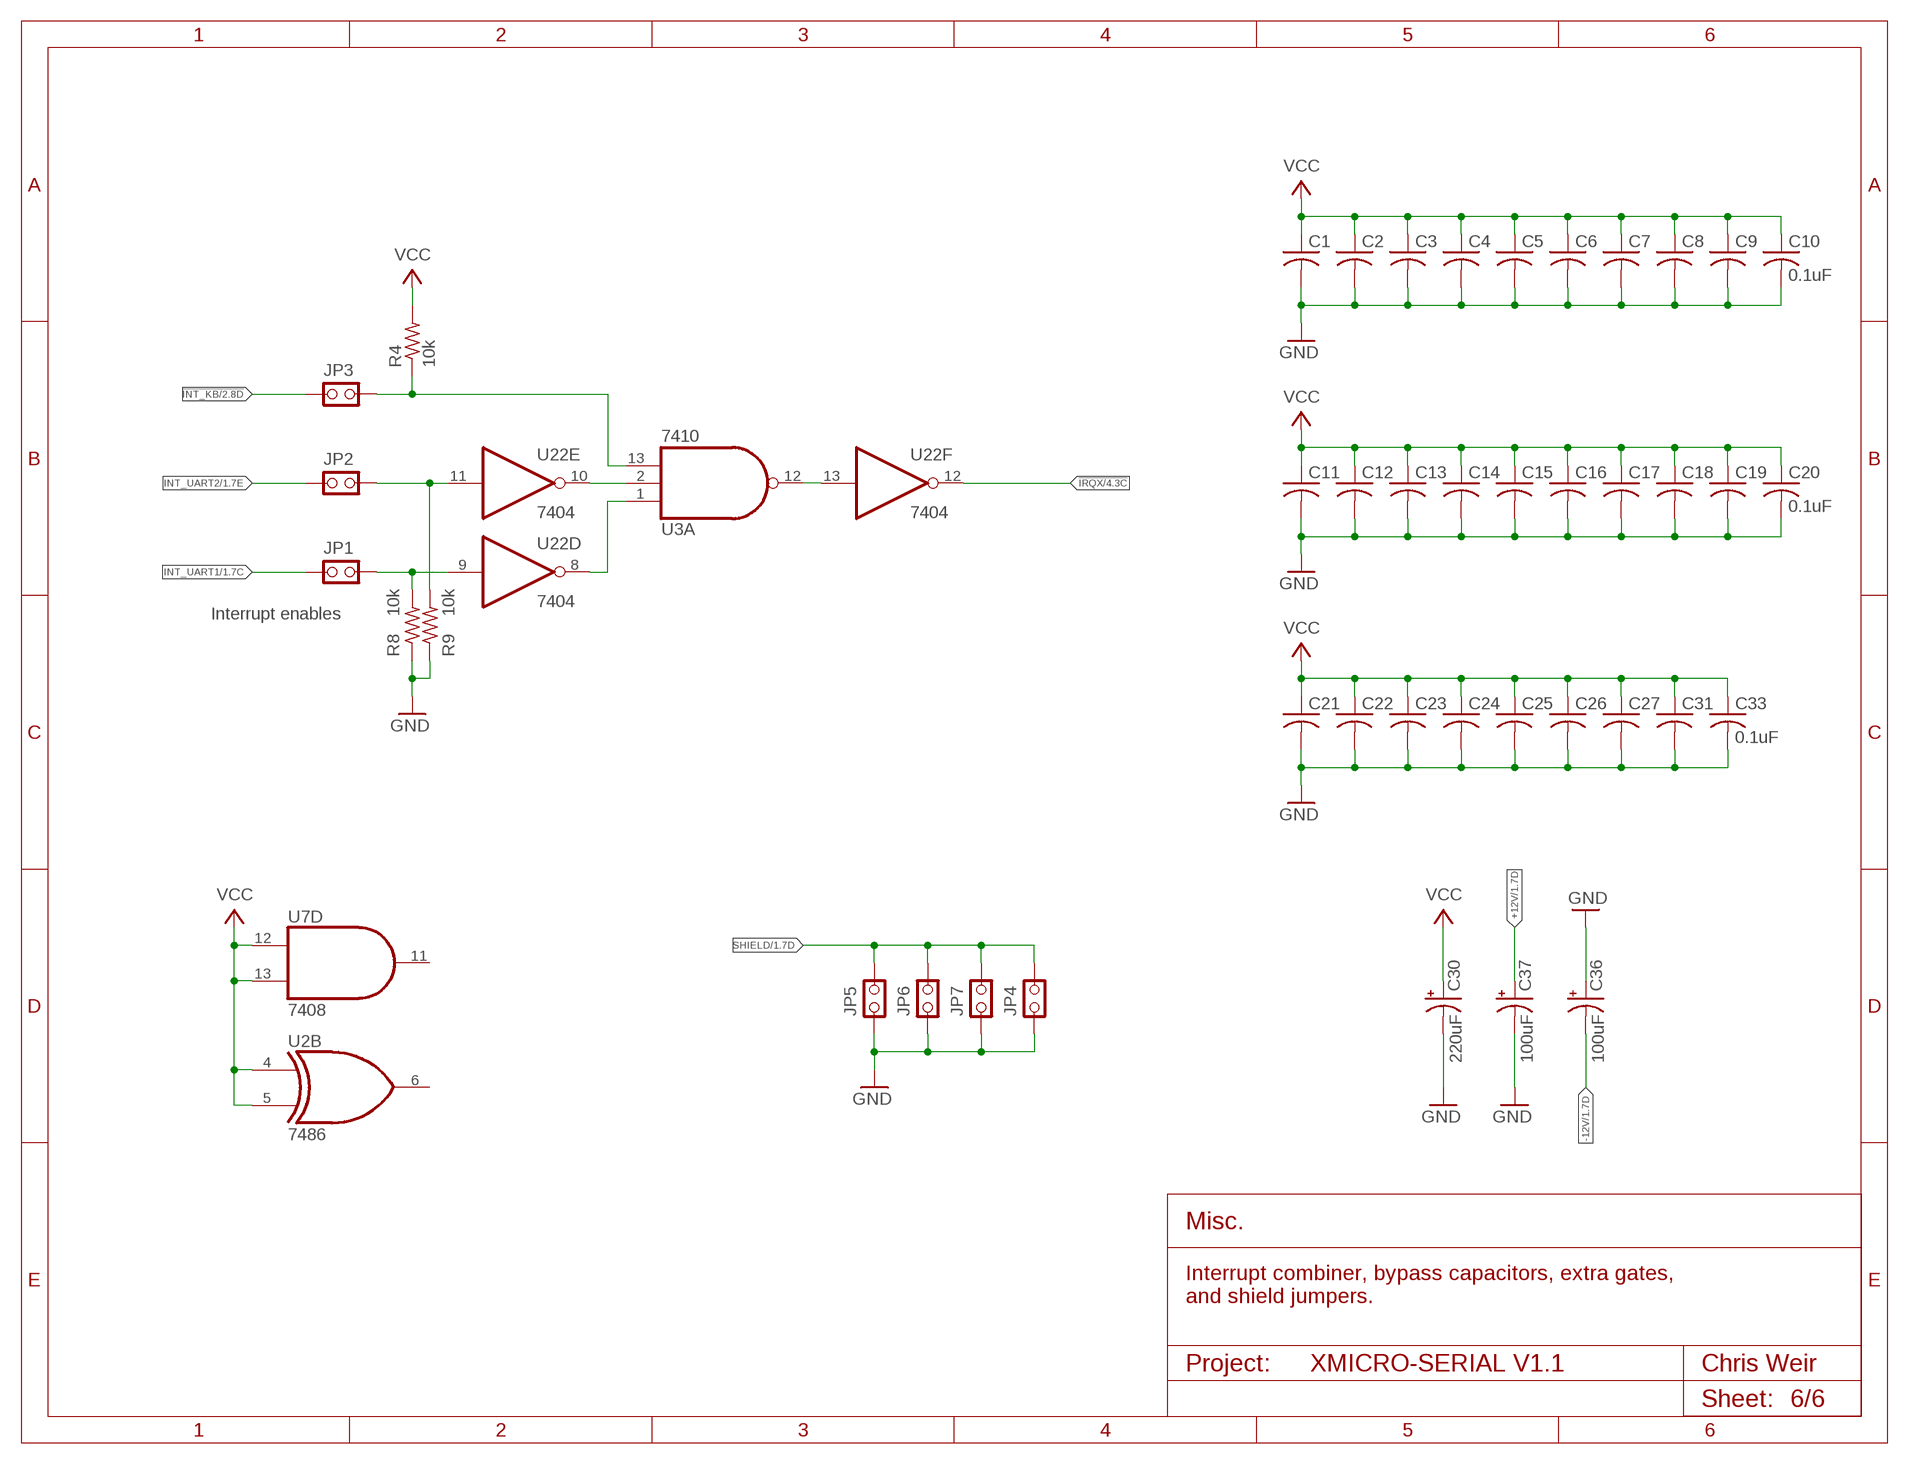
[diagram p5: schematic, sheet 6]

### Parts
C1  0.1uF  C-US100  [C100]
C2  0.1uF  C-US100  [C100]
C3  0.1uF  C-US100  [C100]
C4  0.1uF  C-US100  [C100]
C5  0.1uF  C-US100  [C100]
C6  0.1uF  C-US100  [C100]
C7  0.1uF  C-US100  [C100]
C8  0.1uF  C-US100  [C100]
C9  0.1uF  C-US100  [C100]
C10  0.1uF  C-US100  [C100]
C11  0.1uF  C-US100  [C100]
C12  0.1uF  C-US100  [C100]
C13  0.1uF  C-US100  [C100]
C14  0.1uF  C-US100  [C100]
C15  0.1uF  C-US100  [C100]
C16  0.1uF  C-US100  [C100]
C17  0.1uF  C-US100  [C100]
C18  0.1uF  C-US100  [C100]
C19  0.1uF  C-US100  [C100]
C20  0.1uF  C-US100  [C100]
C21  0.1uF  C-US100  [C100]
C22  0.1uF  C-US100  [C100]
C23  0.1uF  C-US100  [C100]
C24  0.1uF  C-US100  [C100]
C25  0.1uF  C-US100  [C100]
C26  0.1uF  C-US100  [C100]
C27  0.1uF  C-US100  [C100]
C30  220uF  CPOL-US-10-5  [C-10-5]
C31  0.1uF  C-US100  [C100]
C33  0.1uF  C-US100  [C100]
C36  100uF  CPOL-USE2.5-7  [E2,5-7]
C37  100uF  CPOL-USE2.5-7  [E2,5-7]
JP1  PINHD-1X2THRU  [1X02]
JP2  PINHD-1X2THRU  [1X02]
JP3  PINHD-1X2THRU  [1X02]
JP4  PINHD-1X2THRU  [1X02]
JP5  PINHD-1X2THRU  [1X02]
JP6  PINHD-1X2THRU  [1X02]
JP7  PINHD-1X2THRU  [1X02]
R4  10k  R-US_0207/10  [0207/10]
R8  10k  R-US_0207/10  [0207/10]
R9  10k  R-US_0207/10  [0207/10]

### Nets
!INT_KB: JP3.1 ; also sheet 2
!IRQX: U22.12(F:O) ; also sheet 4
+12V [SUPPLY]: C37.+ ; also sheet 1,4
-12V [SUPPLY]: C36.- ; also sheet 1,4
GND [GND]: C1.P$2 C2.P$2 C3.P$2 C4.P$2 C5.P$2 C6.P$2 C7.P$2 C8.P$2 C9.P$2 C10.P$2 C11.P$2 C12.P$2 C13.P$2 C14.P$2 C15.P$2 C16.P$2 C17.P$2 C18.P$2 C19.P$2 C20.P$2 C21.P$2 C22.P$2 C23.P$2 C24.P$2 C25.P$2 C26.P$2 C27.P$2 C30.- C31.P$2 C33.P$2 C36.+ C37.- JP4.1 JP5.1 JP6.1 JP7.1 R8.1 R9.1 ; also sheet 1,2,3,4,5
INT_UART1: JP1.1 ; also sheet 1,5
INT_UART2: JP2.1 ; also sheet 1,5
N$21: U3.12(A:O) U22.13(F:I)
N$24: JP3.2 R4.1 U3.13(A:I2)
N$25: U3.1(A:I0) U22.8(D:O)
N$107: U3.2(A:I1) U22.10(E:O)
N$115: JP1.2 R8.2 U22.9(D:I)
N$118: JP2.2 R9.2 U22.11(E:I)
SHIELD [SHIELD]: JP4.2 JP5.2 JP6.2 JP7.2 ; also sheet 1,2
VCC [SUPPLY]: C1.P$1 C2.P$1 C3.P$1 C4.P$1 C5.P$1 C6.P$1 C7.P$1 C8.P$1 C9.P$1 C10.P$1 C11.P$1 C12.P$1 C13.P$1 C14.P$1 C15.P$1 C16.P$1 C17.P$1 C18.P$1 C19.P$1 C20.P$1 C21.P$1 C22.P$1 C23.P$1 C24.P$1 C25.P$1 C26.P$1 C27.P$1 C30.+ C31.P$1 C33.P$1 R4.2 U2.4(B:I0) U2.5(B:I1) U7.12(D:I0) U7.13(D:I1) ; also sheet 1,2,3,4
Unconnected: U2.6(B:O) U7.11(D:O)

### Notes on the sheet
- Interrupt enables
- Misc.
- Interrupt combiner, bypass capacitors, extra gates,
  and shield jumpers.
- Project: | Chris Weir
- Sheet:

## Power pins joined to a net without a drawn wire
GND: U2.7(P:GND) U3.7(P:GND) U4.7(P:GND) U5.7(P:GND) U6.7(P:GND) U7.7(P:GND) U8.8(GND) U9.8(GND) U10.7(GND) U11.10(GND) U12.7(GND) U13.7(GND) U14.7(P:GND) U15.10(P:GND) U16.10(P:GND) U17.10(P:GND) U18.7(GND) U19.8(GND) U20.8(GND) U21.10(P:GND) U22.7(P:GND) U23.10(GND) U24.22(GND) U25.22(GND)
VCC: U2.14(P:VCC) U3.14(P:VCC) U4.14(P:VCC) U5.14(P:VCC) U6.14(P:VCC) U7.14(P:VCC) U8.16(VCC) U9.16(VCC) U10.14(VCC) U11.20(VCC) U12.14(VCC) U13.14(VCC) U14.14(P:VCC) U15.20(P:VCC) U16.20(P:VCC) U17.20(P:VCC) U18.14(VCC) U19.16(VCC) U20.16(VCC) U21.20(P:VCC) U22.14(P:VCC) U23.20(VCC) U24.44(VCC) U25.44(VCC)

## Library data of the parts
C1-C28 C31 C33-C35 = Custom:C-US
C29 C36 C37 = rcl:CPOL-US: POLARIZED CAPACITOR, American symbol
C30 = Custom:CPOL-US
CE0 = Custom:XMICRO-BUS
J1 J2 = Custom:D9-MP
J3 = Custom:MINI-DIN6
J4 J5 = Custom:PINHD1X3
JP1-JP7 = Custom:PINHD-1X2THRU
Q1-Q3 = Custom:TRANSISTOR-NPN
R1-R9 = resistor:R-US_: RESISTOR, American symbol
RN1 = resistor-sil:G08R: SIL RESISTOR; OC_FARNELL: unknown; OC_NEWARK: unknown
TP1 TP2 = Custom:PINHD-1X1
U1 = st-microelectronics:NE555: General purpose bipolar Timer; MF: Arrow Electronics; MPN: NE555N; OC_FARNELL: 1467742; OC_NEWARK: 89K1486
U2 = 74xx-us:74*86: Quad 2-input EXCLUSIV-OR (XOR) gate
U3 = 74xx-us:74*10: Triple 3-input NAND gate
U4 = 74xx-us:74*04: Hex INVERTER
U5 U6 U14 = 74xx-us:74*74: Dual D type positive edge triggered FLIP FLOP, preset and clear
U7 = 74xx-us:74*08: Quad 2-input AND gate
U8 U9 = 74xx-eu:74*138: 3-line to 8-line DECODER/DEMULTIPLEXER
U10 U18 = 74xx-us:74*280: 9-bit odd/even PARITY GENERATOR/CHECKER
U11 = 74xx-us:74*273: Octal D type FLIP FLOP, clear
U12 U13 = 74xx-us:74*164: 8-bit parallel out SHIFT REGISTER
U15 U16 U21 = 74xx-us:74*244: Octal BUFFER and LINE DRIVER, 3-state
U17 = 74xx-us:74*240: Octal BUFFER and LINE DRIVER, 3-state
U19 U20 = 74xx-us:74*165: 8-bit parallel load SHIFT REGISTER
U22 = 74xx-eu:74*04: Hex INVERTER
U23 = 74xx-us:74*245: Octal BUS TRANSCEIVER, 3-state
U24 U25 = Custom:16C550
U26 U27 = Custom:75C185
Y1 = Custom:OSC-OE

## Net classes
0 default: width 0.254 mm
1 GND: width 0.254 mm, clearance 0.254 mm to class 0
2 SHIELD: width 0.254 mm, clearance 0.762 mm to class 0, clearance 0.762 mm to class 1
3 SUPPLY: width 0.254 mm, clearance 0.381 mm to class 0, clearance 0.381 mm to class 1, clearance 0.762 mm to class 2, clearance 0.381 mm
4 LOGO: width 0.152 mm